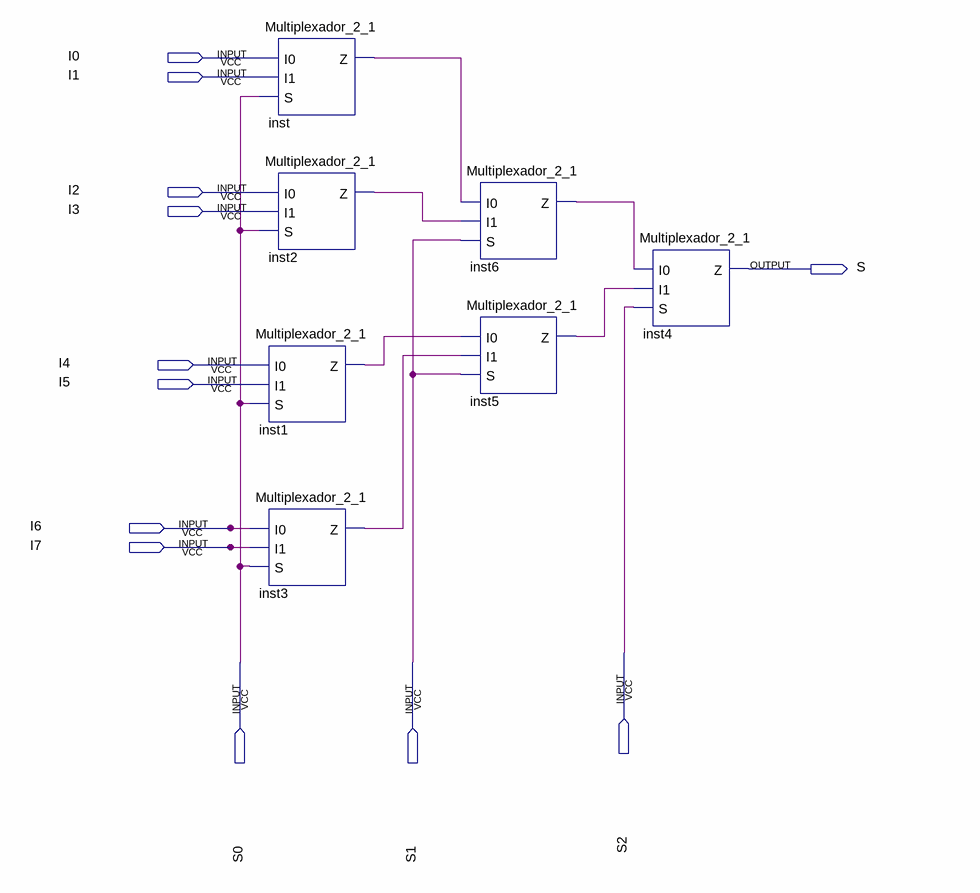
[diagram p0: schematic sheet]
// Quartus schematic Multiplexador_8_1_por_2_1.bdf as structural Verilog: 7 symbols, 12 pins
module Multiplexador_8_1_por_2_1 (
  input  I0,
  input  I1,
  input  I2,
  input  I3,
  input  I4,
  input  I5,
  input  I6,
  input  I7,
  input  S2,
  input  S0,
  input  S1,
  output S
);

  wire inst1_z, inst2_z, inst3_z, inst5_z, inst6_z, inst_z;

  Multiplexador_2_1 inst (.S(S0), .Z(inst_z));  // open: I0, I1
  Multiplexador_2_1 inst2 (.S(S0), .Z(inst2_z));  // open: I0, I1
  Multiplexador_2_1 inst1 (.S(S0), .Z(inst1_z));  // open: I0, I1
  Multiplexador_2_1 inst3 (.I0(I6), .I1(I7), .S(S0), .Z(inst3_z));
  Multiplexador_2_1 inst6 (.I0(inst_z), .I1(inst2_z), .S(S1), .Z(inst6_z));
  Multiplexador_2_1 inst5 (.I0(inst1_z), .I1(inst3_z), .S(S1), .Z(inst5_z));
  Multiplexador_2_1 inst4 (.I0(inst6_z), .I1(inst5_z), .S(S2), .Z(S));
endmodule
